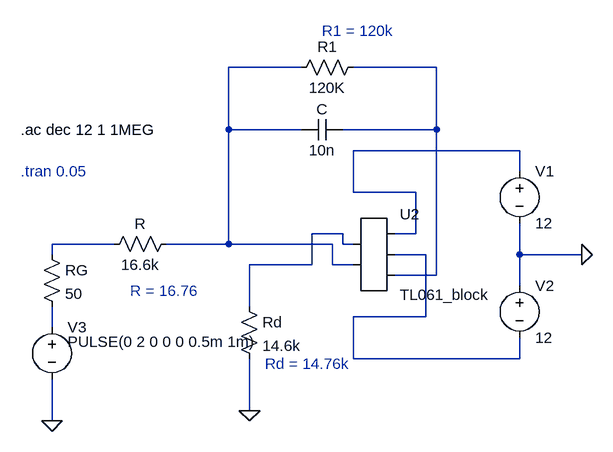
[diagram p0: schematic integrating-circuit.asc]
integrating-circuit.asc, the LTspice schematic file:
Version 4
SHEET 1 952 680
WIRE 256 96 144 96
WIRE 464 96 336 96
WIRE 144 192 144 96
WIRE 256 192 144 192
WIRE 464 192 464 96
WIRE 464 192 320 192
WIRE 592 224 336 224
WIRE 592 256 592 224
WIRE 336 288 336 224
WIRE 432 288 336 288
WIRE 320 352 272 352
WIRE 432 352 432 288
WIRE 432 352 400 352
WIRE -32 368 -128 368
WIRE 144 368 144 192
WIRE 144 368 48 368
WIRE 304 368 144 368
WIRE 320 368 320 352
WIRE 336 368 320 368
WIRE -128 384 -128 368
WIRE 448 384 400 384
WIRE 592 384 592 336
WIRE 688 384 592 384
WIRE 272 400 272 352
WIRE 272 400 176 400
WIRE 304 400 304 368
WIRE 336 400 304 400
WIRE 464 416 464 192
WIRE 464 416 400 416
WIRE 592 432 592 384
WIRE 176 464 176 400
WIRE 448 480 448 384
WIRE 448 480 336 480
WIRE -128 496 -128 464
WIRE 336 544 336 480
WIRE 592 544 592 512
WIRE 592 544 336 544
WIRE 176 624 176 544
WIRE -128 640 -128 576
FLAG 688 384 0
FLAG -128 640 0
FLAG 176 624 0
SYMBOL res 352 80 R90
WINDOW 0 0 56 VBottom 2
WINDOW 3 32 56 VTop 2
SYMATTR InstName R1
SYMATTR Value 120K
SYMBOL res 64 352 R90
WINDOW 0 0 56 VBottom 2
WINDOW 3 32 56 VTop 2
SYMATTR InstName R
SYMATTR Value 16.6k
SYMBOL cap 320 176 R90
WINDOW 0 0 32 VBottom 2
WINDOW 3 32 32 VTop 2
SYMATTR InstName C
SYMATTR Value 10n
SYMATTR SpiceLine Rser=254.8m Lser=0 mfg="KEMET" pn="C0402C153K5RAC" type="X7R"
SYMBOL voltage 592 240 R0
SYMATTR InstName V1
SYMATTR Value 12
SYMBOL voltage 592 416 R0
SYMATTR InstName V2
SYMATTR Value 12
SYMBOL res 160 448 R0
SYMATTR InstName Rd
SYMATTR Value 14.6k
SYMBOL res -144 368 R0
SYMATTR InstName RG
SYMATTR Value 50
SYMBOL voltage -128 480 R0
WINDOW 3 24 38 Left 2
SYMATTR Value PULSE(0 2 0 0 0 0.5m 1m)
SYMATTR InstName V3
SYMATTR Value2 AC 2 0
SYMBOL AutoGenerated/TL061_block 368 384 R0
SYMATTR InstName U2
TEXT -176 192 Left 2 !.ac dec 12 1 1MEG
TEXT -176 256 Left 2 ;.tran 0.05
TEXT 200 552 Left 2 ;Rd = 14.76k
TEXT 288 40 Left 2 ;R1 = 120k
TEXT -8 440 Left 2 ;R = 16.76

The netlist it stands for:
* integrating-circuit.asc
R1 N002 N001 120K
R N001 N005 16.6k
C N002 N001 10n Rser=254.8m Lser=0 mfg="KEMET" pn="C0402C153K5RAC" type="X7R"
V1 N003 0 12
V2 0 N006 12
Rd N004 0 14.6k
RG N005 N007 50
V3 N007 0 PULSE(0 2 0 0 0 0.5m 1m) AC 2 0
* U2: TL061_block (symbol AutoGenerated/TL061_block not available, pins judged from their places): pin1=N004 pin2=N001 pin3=N003 pin4=N006 pin5=N002
.ac dec 12 1 1MEG
* .tran 0.05
* Rd = 14.76k
* R1 = 120k
* R = 16.76
.backanno
.end